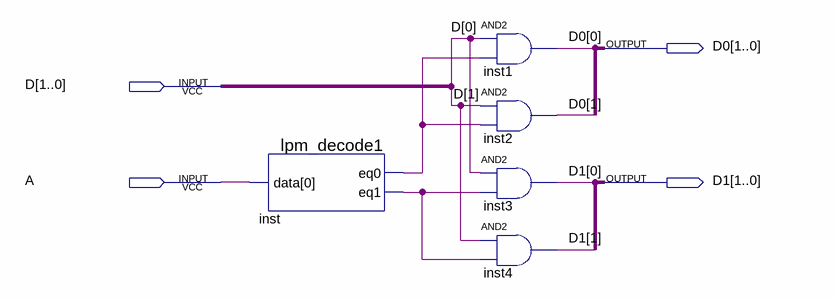
[diagram p0: schematic sheet]
// Quartus schematic DMUX2_.bdf as structural Verilog: 5 symbols, 4 pins
module DMUX2_ (
  input  [1:0] D,
  input  A,
  output [1:0] D0,
  output [1:0] D1
);

  wire inst_eq0, inst_eq1;

  lpm_decode1 inst (.data(A), .eq0(inst_eq0), .eq1(inst_eq1));
  and inst1 (D0[0], D[0], inst_eq0);
  and inst2 (D0[1], D[1], inst_eq0);
  and inst3 (D1[0], D[0], inst_eq1);
  and inst4 (D1[1], D[1], inst_eq1);
endmodule
